# Altium schematic sheet motor.SchDoc
size A3
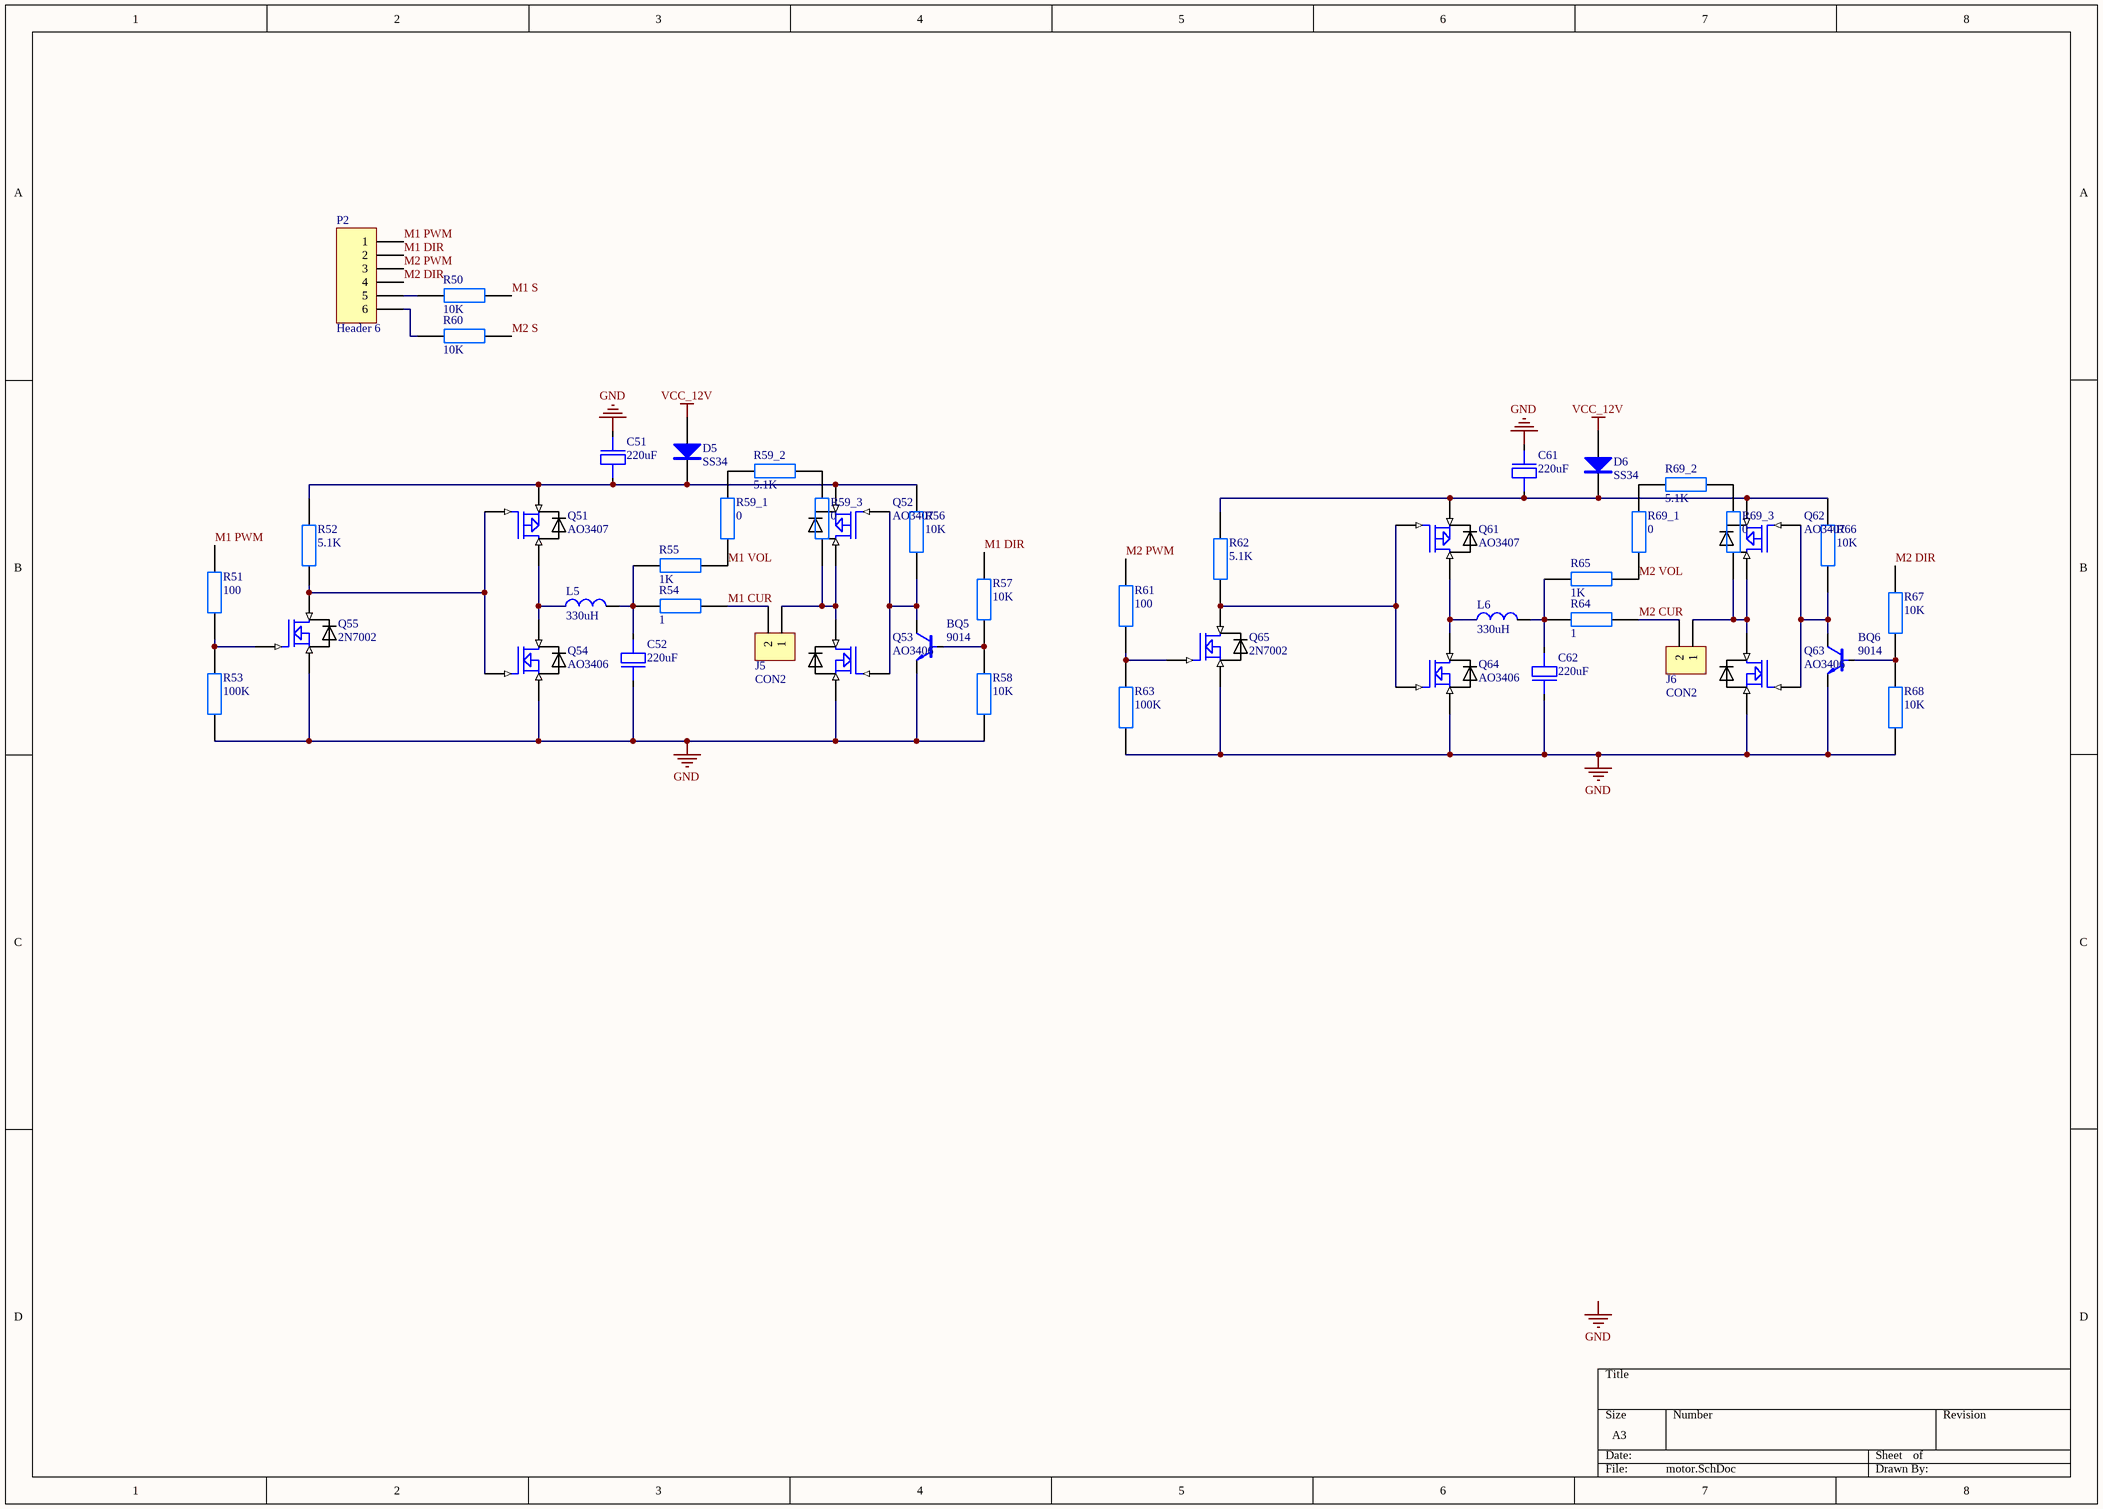
[diagram p0: motor.SchDoc]

## Parts
BQ5  9014  [SOT-23]
BQ6  9014  [SOT-23]
C51  220uF  [SMD-EC-F10]
C52  220uF  [SMD-EC-F10]
C61  220uF  [SMD-EC-F10]
C62  220uF  [SMD-EC-F10]
D5  SS34  [SMA]
D6  SS34  [SMA]
J5  CON2  [con2]
J6  CON2  [con2]
L5  330uH  [12x12]
L6  330uH  [12x12]
P2  Header 6  [HDR1X6]
Q51  AO3407  [sot-23]
Q52  AO3407  [sot-23]
Q53  AO3406  [sot-23]
Q54  AO3406  [sot-23]
Q55  2N7002  [sot-23]
Q61  AO3407  [sot-23]
Q62  AO3407  [sot-23]
Q63  AO3406  [sot-23]
Q64  AO3406  [sot-23]
Q65  2N7002  [sot-23]
R50  10K  [0805]
R51  100  [0805]
R52  5.1K  [0805]
R53  100K  [0805]
R54  1  [2512]
R55  1K  [0805]
R56  10K  [0805]
R57  10K  [0805]
R58  10K  [0805]
R59_1  0  [0805]
R59_2  5.1K  [0805]
R59_3  0  [0805]
R60  10K  [0805]
R61  100  [0805]
R62  5.1K  [0805]
R63  100K  [0805]
R64  1  [2512]
R65  1K  [0805]
R66  10K  [0805]
R67  10K  [0805]
R68  10K  [0805]
R69_1  0  [0805]
R69_2  5.1K  [0805]
R69_3  0  [0805]

## Nets
GND: BQ5.e BQ6.e C51.2 C52.2 C61.2 C62.2 Q53.3(S) Q54.3(S) Q55.3(S) Q63.3(S) Q64.3(S) Q65.3(S) R53.1 R58.1 R63.1 R68.1
VCC_12V: D5.1(A) D6.1(A)
M1 CUR: J5.2 R54.2
M1 DIR: P2.2 R57.2
M1 PWM: P2.1 R51.2
M1 S: R50.1
M1 VOL: R55.2 R59_1.1
M2 CUR: J6.2 R64.2
M2 DIR: P2.4 R67.2
M2 PWM: P2.3 R61.2
M2 S: R60.1
M2 VOL: R65.2 R69_1.1
NetBQ5_b: BQ5.b R57.1 R58.2
NetBQ5_c: BQ5.c Q52.1(G) Q53.1(G) R56.1
NetBQ6_b: BQ6.b R67.1 R68.2
NetBQ6_c: BQ6.c Q62.1(G) Q63.1(G) R66.1
NetC51_1: C51.1 D5.2(K) Q51.3(S) Q52.3(S) R52.2 R56.2
NetC52_1: C52.1 L5.1 R54.1 R55.1
NetC61_1: C61.1 D6.2(K) Q61.3(S) Q62.3(S) R62.2 R66.2
NetC62_1: C62.1 L6.1 R64.1 R65.1
NetJ5_1: J5.1 Q52.2(D) Q53.2(D) R59_3.1
NetJ6_1: J6.1 Q62.2(D) Q63.2(D) R69_3.1
NetL5_2: L5.2 Q51.2(D) Q54.2(D)
NetL6_2: L6.2 Q61.2(D) Q64.2(D)
NetP2_5: P2.5 R50.2
NetP2_6: P2.6 R60.2
NetQ51_1: Q51.1(G) Q54.1(G) Q55.2(D) R52.1
NetQ55_1: Q55.1(G) R51.1 R53.2
NetQ61_1: Q61.1(G) Q64.1(G) Q65.2(D) R62.1
NetQ65_1: Q65.1(G) R61.1 R63.2
NetR59_1_2: R59_1.2 R59_2.1
NetR59_2_2: R59_2.2 R59_3.2
NetR69_1_2: R69_1.2 R69_2.1
NetR69_2_2: R69_2.2 R69_3.2

## Notes on the sheet
- Labels drawn without touching a wire or pin: GND

## Library data of the parts
BQ5 BQ6 = 9014: transistor; pin to pad: b>1 c>3 e>2
C51 C52 C61 C62 = Electrolytic CAP: VALUE: 220uF
D5 D6 = SS14: Diode
L5 L6 = Inductance: value: 330uH
P2 = Header 6: Header, 6-Pin; LatestRevisionDate: 17-Jul-2002; LatestRevisionNote: Re-released for DXP Platform.; Publisher: Altium Limited
Q51 Q52 Q61 Q62 = AO3407: pin to pad: 2>3 3>2
Q53 Q54 Q63 Q64 = AO3406: pin to pad: 2>3 3>2
Q55 Q65 = 2N7002: pin to pad: 2>3 3>2
R50-R58 R59_1-R59_3 R60-R68 R69_1-R69_3 = RES
  R50 R56-R58 R60 R66-R68: VALUE: 10K
  R51 R61: VALUE: 100
  R52 R59_2 R62 R69_2: VALUE: 5.1K
  R53 R63: VALUE: 100K
  R54 R64: VALUE: 1
  R55 R65: VALUE: 1K
  R59_1 R59_3 R69_1 R69_3: VALUE: 0